# EAGLE design WiFi_UART_Board_R1_0_1 (EAGLE 6.6.0)
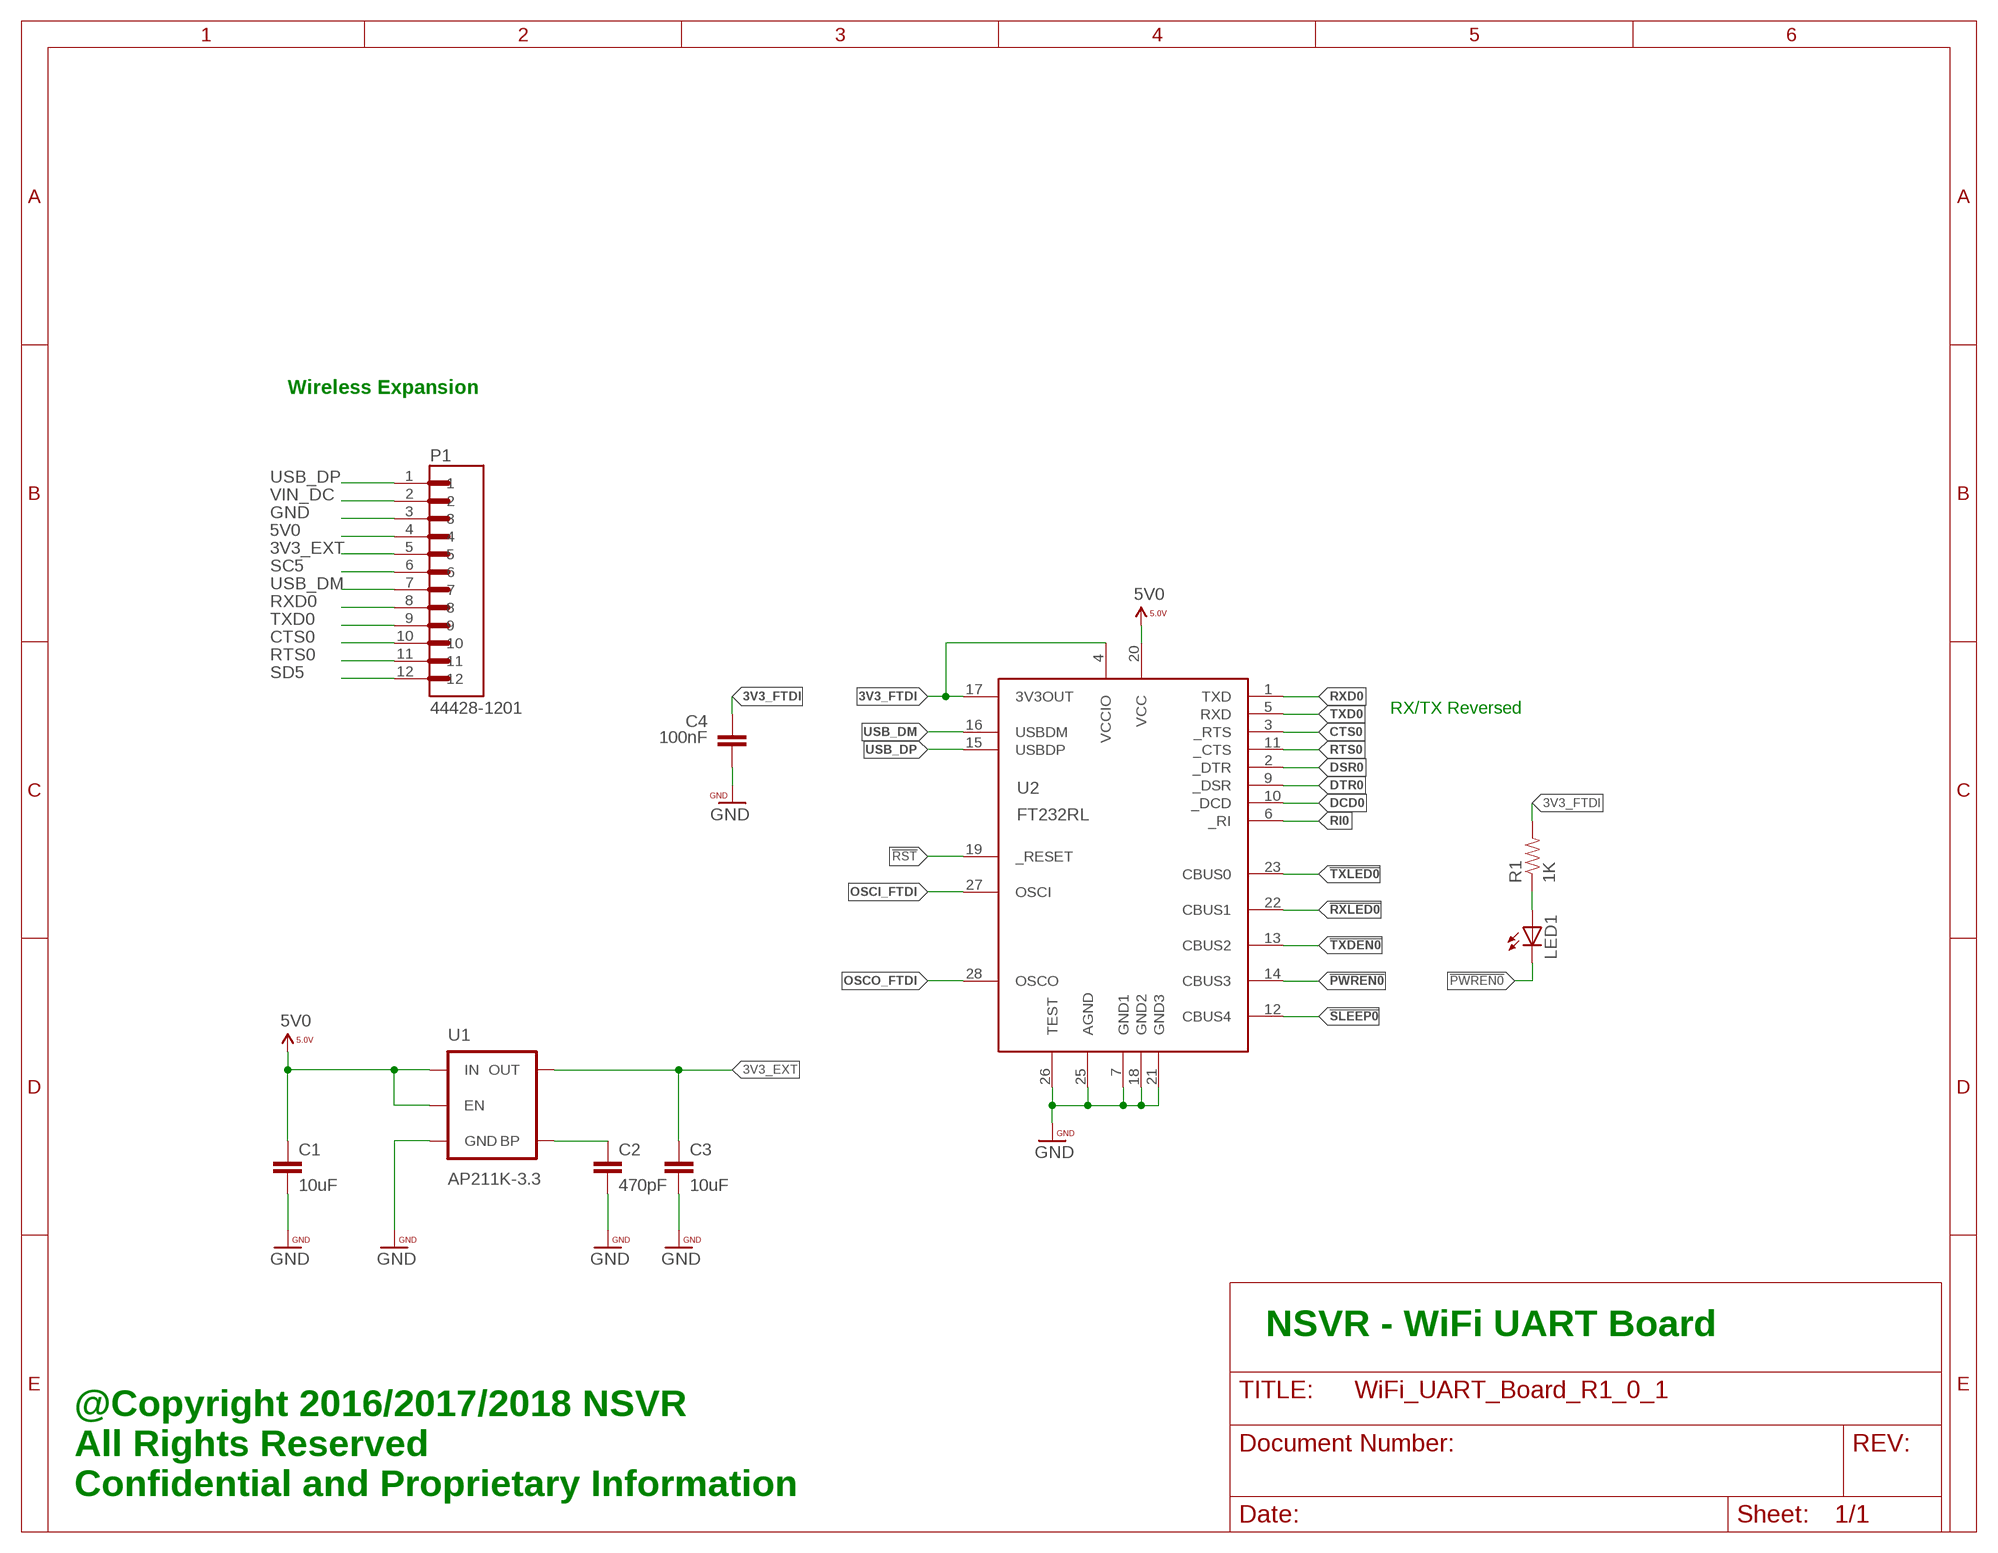
[diagram p0: schematic, sheet 1]

## Parts
C1  10uF  CAP0603-CAP  [0603-CAP]
C2  470pF  CAP0402-CAP  [0402-CAP]
C3  10uF  CAP0603-CAP  [0603-CAP]
C4  100nF  CAP0402-CAP  [0402-CAP]
LED1  LEDCHIP-LED0603  [CHIP-LED0603]
P1  44428-1201  [MOLEX_44428-1201]
R1  1K  RESISTOR0402-TYP  [EIA-0402]
U1  AP211K-3.3  V_REG_MIC52053.3V  [SOT23-5]
U2  FT232RL  [SSOP28DB]

## Nets
3V3_EXT: C3.1 P1.5 U1.5(OUT)
3V3_FTDI: C4.1 R1.2 U2.4(VCCIO) U2.17(3V3OUT)
5V0: C1.1 P1.4 U1.1(IN) U1.3(EN) U2.20(VCC)
!PWREN0: LED1.C U2.14(CBUS3)
!RST: U2.19(_RESET)
!RXLED0: U2.22(CBUS1)
!SLEEP0: U2.12(CBUS4)
!TXDEN0: U2.13(CBUS2)
!TXLED0: U2.23(CBUS0)
CTS0: P1.10 U2.3(_RTS)
DCD0: U2.10(_DCD)
DSR0: U2.2(_DTR)
DTR0: U2.9(_DSR)
GND: C1.2 C2.2 C3.2 C4.2 P1.3 U1.2(GND) U2.7(GND1) U2.18(GND2) U2.21(GND3) U2.25(AGND) U2.26(TEST)
N$1: LED1.A R1.1
N$7: C2.1 U1.4(BP)
OSCI_FTDI: U2.27(OSCI)
OSCO_FTDI: U2.28(OSCO)
RI0: U2.6(_RI)
RTS0: P1.11 U2.11(_CTS)
RXD0: P1.8 U2.1(TXD)
SC5: P1.6
SD5: P1.12
TXD0: P1.9 U2.5(RXD)
USB_DM: P1.7 U2.16(USBDM)
USB_DP: P1.1 U2.15(USBDP)
VIN_DC: P1.2

## Notes on the sheet
- Wireless Expansion
- RX/TX Reversed
- NSVR - WiFi UART Board
- @Copyright 2016/2017/2018 NSVR
  All Rights Reserved
  Confidential and Proprietary Information

## Library data of the parts
C1-C4 = PatternAgents-ProtoPads:CAP: Capacitor Standard 0603 ceramic capacitor, and 0.1" leaded capacitor.
LED1 = led:LED: LED OSRAM: - CHIPLED LG R971, LG N971, LY N971, LG Q971, LY Q971, LO R971, LY R971 LH N974, LH R974 LS Q976, LO Q976, LY Q976 LO Q996 - Hyper CHIPLED LW Q18S LB Q993, LB Q99A, LB R99A - SideLED LS A670, LO A670, LY A670, LG A670, LP A670 LB A673, LV A673, LT A673, LW A673 LH A674 LY A675 LS A676, LA A676, LO A676, LY A676, LW A676 LS A679, LY A679, LG A679 - Hyper Micro SIDELED® LS Y876, LA Y876, LO Y876, LY Y876 LT Y87S - SmartLED LW L88C, LW L88S LB L89C, LB L89S, LG L890 LS L89K, LO L89K, LY L89K LS L896, LA L896, LO L896, LY L896 - TOPLED LS T670, LO T670, LY T670, LG T670, LP T670 LSG T670, LSP T670, LSY T670, LOP T670, LYG T670 LG T671, LOG T671, LSG T671 LB T673, LV T673, LT T673, LW T673 LH T674 LS T676, LA T676, LO T676, LY T676, LB T676, LH T676, LSB T676, LW T676 LB T67C, LV T67C, LT T67C, LS T67K, LO T67K, LY T67K, LW E67C LS E67B, LA E67B, LO E67B, LY E67B, LB E67C, LV E67C, LT E67C LW T67C LS T679, LY T679, LG T679 LS T770, LO T770, LY T770, LG T770, LP T770 LB T773, LV T773, LT T773, LW T773 LH T774 LS E675, LA E675, LY E675, LS T675 LS T776, LA T776, LO T776, LY T776, LB T776 LHGB T686 LT T68C, LB T68C - Hyper Mini TOPLED® LB M676 - Mini TOPLED Santana® LG M470 LS M47K, LO M47K, LY M47K Source: http://www.osram.convergy.de LUXEON: - LUMILED® LXK2-PW12-R00, LXK2-PW12-S00, LXK2-PW14-U00, LXK2-PW14-V00 LXK2-PM12-R00, LXK2-PM12-S00, LXK2-PM14-U00 LXK2-PE12-Q00, LXK2-PE12-R00, LXK2-PE12-S00, LXK2-PE14-T00, LXK2-PE14-U00 LXK2-PB12-K00, LXK2-PB12-L00, LXK2-PB12-M00, LXK2-PB14-N00, LXK2-PB14-P00, LXK2-PB14-Q00 LXK2-PR12-L00, LXK2-PR12-M00, LXK2-PR14-Q00, LXK2-PR14-R00 LXK2-PD12-Q00, LXK2-PD12-R00, LXK2-PD12-S00 LXK2-PH12-R00, LXK2-PH12-S00 LXK2-PL12-P00, LXK2-PL12-Q00, LXK2-PL12-R00 Source: www.luxeon.com KINGBRIGHT: KA-3528ASYC Source: www.kingbright.com
P1 = 44428-1201:44428-1201: Conn Wire to Board HDR 12 POS 3mm Solder RA Thru-Hole Micro-Fit 3.0 BMI? Tray; AVAILABILITY: Good; DESCRIPTION: Conn Wire to Board HDR 12 POS 3mm Solder RA Thru-Hole Micro-Fit 3.0 BMI? Tray; MF: Molex; MP: 44428-1201; PACKAGE: None; PRICE: 2.39 USD
R1 = PatternAgents-ProtoPads:RESISTOR: Resistor Basic schematic elements and footprints for 0603, 1206, and PTH resistors.
U1 = SparkFun-PowerIC:V_REG_MIC5205: V_REG MIC5205 Standard 3.3V, 5V, and Adjustable 150mA LDO voltage regulator in SOT-23 layout. Micrel part MIC5205. BP (by-pass) pin is used to lower output noise with 470pF cap, may be left open. On the adjustable version BP is used to set output.; PROD_ID: VREG-00822; VALUE: 3.3V/150mA
U2 = ftdichip-3:FT232RL: USB UART 4th Generation USB UART (USB <-> Serial) Controller

## Board
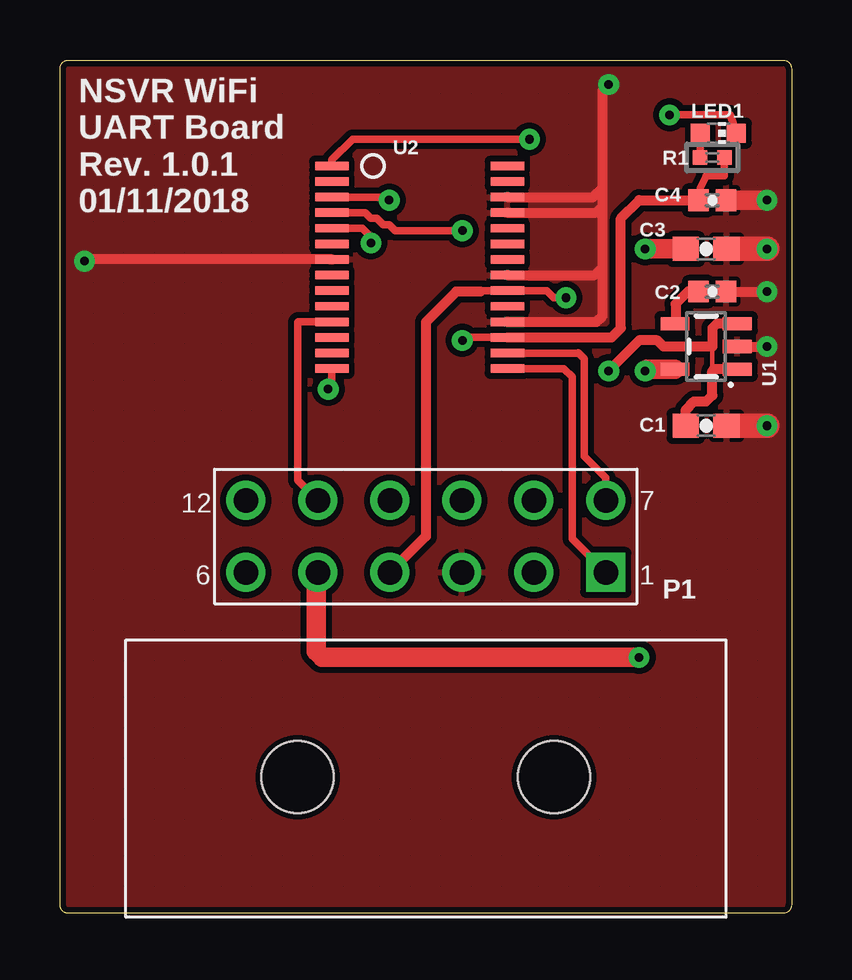
[diagram p1: board, top side]
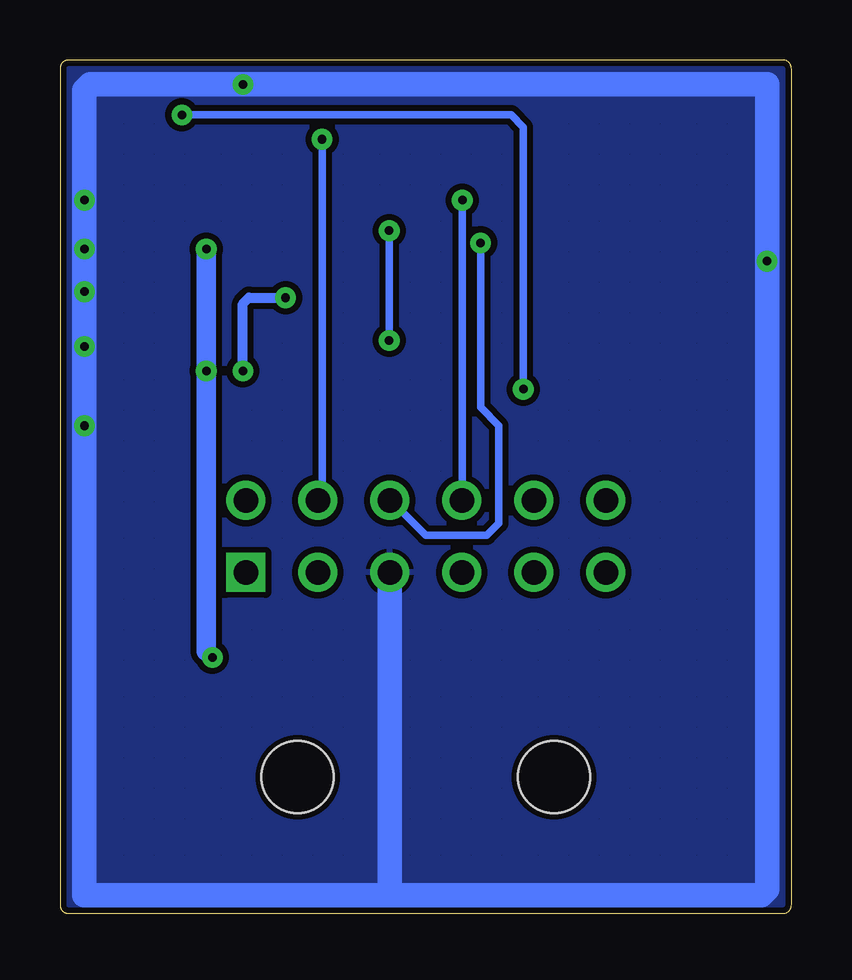
[diagram p2: board, bottom side, seen from below]

Size 30.48 x 35.56 mm. Coordinates in mm from the lower left corner, seen from the top.
Outline: 0.36,35.56 30.12,35.56 arc-90 30.48,35.2 30.48,0.36 arc-90 30.12,0 0.36,0 arc-90 0,0.36 0,35.2 arc-90 0.36,35.56
Copper layers (1*16): Top 0.035mm / dielectric 1.5mm / Bottom 0.035mm
Design rules "PatternAgents_7mil": minimum track width 7mil, minimum drill 14mil, track to track 7mil, track to pad 7mil, pad to pad 7mil, via to via 7mil, smd to smd 7mil, copper to edge 7mil, drill to drill 7mil, minimum pad ring 12mil, minimum via ring 10mil, stop-mask expansion 4mil, vias tented up to drill 25mil, thermal gap 7mil

### Footprints (pad centres in the part's own frame; a part is rotated, then mirrored left to right if it is on the bottom)
0603-CAP = smd 1.1 x 1: 1 -0.85,0; 2 0.85,0
0402-CAP = smd 0.85 x 0.9: 1 -0.58,0; 2 0.58,0
CHIP-LED0603 = smd 0.8 x 0.8: A 0,-0.75; C 0,0.75
MOLEX_44428-1201 = drill 1.02 square: 1 7.5,5.065 | drill 1.02: 2 4.5,5.065; 3 1.5,5.065; 4 -1.5,5.065; 5 -4.5,5.065; 6 -7.5,5.065; 7 7.5,8.065; 8 4.5,8.065; 9 1.5,8.065; 10 -1.5,8.065; 11 -4.5,8.065; 12 -7.5,8.065 | hole 3: -5.34,-3.465; 5.34,-3.465
EIA-0402 = smd 0.6 x 0.6: 1 -0.508,0; 2 0.508,0
SOT23-5 = smd 0.55 x 1.2: 1 -0.95,-1.3; 2 0,-1.3; 3 0.95,-1.3; 4 0.95,1.3; 5 -0.95,1.3
SSOP28DB = smd 0.348 x 1.397: 1 -4.225,-3.656; 2 -3.575,-3.656; 3 -2.925,-3.656; 4 -2.275,-3.656; 5 -1.625,-3.656; 6 -0.975,-3.656; 7 -0.325,-3.656; 8 0.325,-3.656; 9 0.975,-3.656; 10 1.625,-3.656; 11 2.275,-3.656; 12 2.925,-3.656; 13 3.575,-3.656; 14 4.225,-3.656; 15 4.225,3.656; 16 3.575,3.656; 17 2.925,3.656; 18 2.275,3.656; 19 1.625,3.656; 20 0.975,3.656; 21 0.325,3.656; 22 -0.325,3.656; 23 -0.975,3.656; 24 -1.625,3.656; 25 -2.275,3.656; 26 -2.925,3.656; 27 -3.575,3.656; 28 -4.225,3.656

### Placement (x,y rotation side)
C1  26.92,20.32 0 top
C2  27.18,25.91 0 top
C3  26.92,27.69 0 top
C4  27.18,29.72 0 top
LED1  27.43,32.51 270 top
P1  15.24,9.14 0 top
R1  27.18,31.5 0 top
U1  26.92,23.62 90 top
U2  14.99,26.92 270 top

### Tracks (layer width: path | path; a pad name or v marks a point on that pad's centre or on a via)
3V3_EXT  (via drill 0.36)
  Top 0.813: C3.1 v24.38,27.69 | v24.13,10.67 10.92,10.67 10.67,10.92 10.67,14.14 P1.5 | U1.5 24.45,22.67 v24.38,22.61
  Bottom 0.813: v24.38,27.69 v24.38,22.61 24.38,10.92 v24.13,10.67
3V3_FTDI  (via drill 0.36)
  Top 0.305: R1.2 27.69,30.73 26.92,30.73 26.67,30.23 26.67,29.79 C4.1 | U2.4 12.71,29.2 12.95,28.96 13.21,28.96 13.46,28.7 13.72,28.7 13.97,28.45 v16.76,28.45 | U2.17 16.89,24 v16.76,23.88
  Top 0.406: U2.17 22.98,24 23.37,24.38 23.37,28.96 24.13,29.72 C4.1
  Bottom 0.305: v16.76,28.45 v16.76,23.88
5V0  (via drill 0.36)
  Top 0.178: 27.18,23.62 27.18,22.86 27.24,22.67
  Top 0.305: v21.08,25.65 20.57,25.65 20.28,25.95 U2.20 17.57,25.95 17.53,25.91
  Top 0.406: C1.1 26.07,20.99 26.42,21.34 26.92,21.34 27.18,21.59 27.18,22.61 27.24,22.67 U1.1 | U1.3 27.37,24.57 27.18,24.38 27.18,23.62 25.15,23.62 24.89,23.88 24.13,23.88 v22.86,22.61 | 17.53,25.91 16.51,25.91 15.24,24.64 15.24,15.71 P1.4
  Bottom 0.406: v22.86,22.61 22.86,25.4 22.61,25.65 v21.08,25.65
!PWREN0  (via drill 0.36)
  Top 0.305: U2.14 11.33,22 v11.18,21.84 | v25.4,33.27 27.93,33.27 LED1.C
  Bottom 0.305: v11.18,21.84 11.18,32.77 11.68,33.27 v25.4,33.27
CTS0  (via drill 0.36)
  Top 0.305: U2.3 13.59,29.85 v13.72,29.72
  Bottom 0.305: v13.72,29.72 13.72,17.23 P1.10
GND  (via drill 0.36)
  Top 0.406: U1.2 v29.46,23.62 | C2.2 v29.46,25.91 | U2.7 1.09,27.25 v1.02,27.18 | U2.18 22.36,24.65 22.61,24.89 22.61,26.92 | 22.61,26.92 22.61,29.46 | 22.61,29.46 22.61,30.23 | 22.61,30.23 22.61,34.29 v22.86,34.54 | U2.26 22.23,29.85 22.61,30.23 | U2.25 22.34,29.2 22.61,29.46 | U2.21 22.28,26.6 22.61,26.92
  Top 0.813: C4.2 v29.46,29.72
  Top 1.016: C3.2 v29.46,27.69 | C1.2 v29.46,20.32
  Bottom 0.813: v29.46,29.72 29.46,31.75
  Bottom 1.016: P1.3 16.74,0.79 16.76,0.76 | 16.76,0.76 1.27,0.76 1.02,1.02 v1.02,27.18 1.02,34.54 v22.86,34.54 29.21,34.54 29.46,34.29 v29.46,29.72 v29.46,27.69 v29.46,25.91 v29.46,23.62 v29.46,20.32 29.46,0.76 16.76,0.76
  pour Top (isolate 0.254, hatched): 0,0 0,35.56 30.48,35.56 30.48,0
  pour Bottom (isolate 0.254, hatched): 0,0 0,35.56 30.48,35.56 30.48,0
N$1
  Top 0.305: LED1.A 26.68,31.51 R1.1
N$7
  Top 0.406: C2.1 26.16,25.91 25.65,25.4 25.65,24.6 U1.4
RTS0
  Top 0.305: U2.11 9.92,24.65 9.91,24.64 9.91,18.04 P1.11
RXD0  (via drill 0.36)
  Top 0.305: U2.1 11.33,31.4 12.19,32.26 v19.56,32.26
  Bottom 0.305: v19.56,32.26 19.56,17.39 P1.8
TXD0  (via drill 0.36)
  Top 0.305: v12.95,27.94 12.95,28.19 12.6,28.55 U2.5
  Bottom 0.305: P1.9 16.7,17.21 15.24,15.75 12.7,15.75 12.19,16.26 12.19,20.32 12.95,21.08 v12.95,27.94
USB_DM
  Top 0.305: P1.7 22.74,18.15 21.84,19.05 21.84,23.11 21.59,23.37 21.57,23.35 U2.16
USB_DP
  Top 0.305: U2.15 20.99,22.7 21.34,22.35 21.34,15.61 P1.1

### Text on the board
tPlace: NSVR WiFi / UART Board / Rev. 1.0.1 / 01/11/2018